# Altium project Team FF7 HD Remastered.PrjPcb
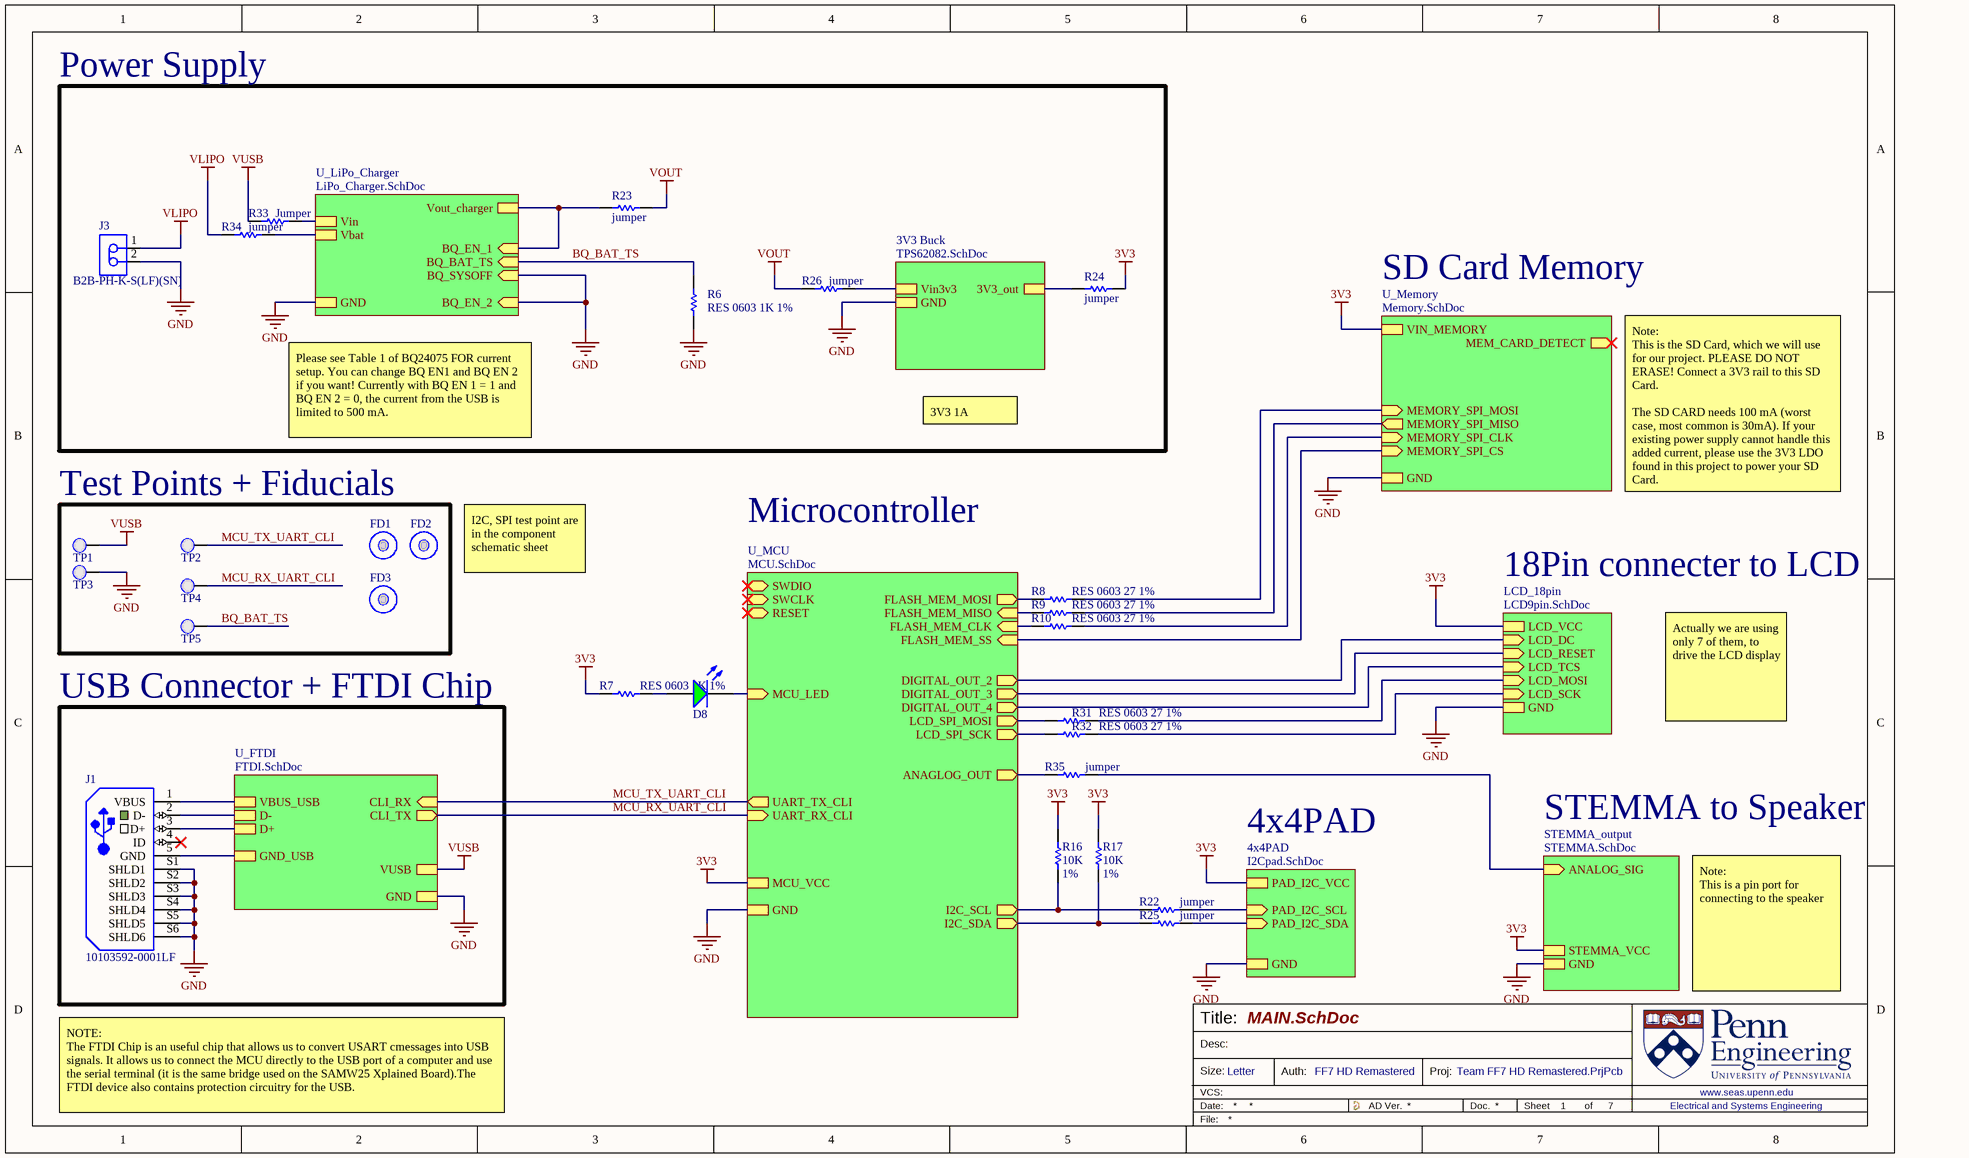
[diagram p0: MAIN.SchDoc]
9 sheets, 103 parts. Net scope: strictly hierarchical (ports join the sheet entries above them; power ports are local).
Board file: FF7_V1.0.PcbDoc
Sheets:
  MAIN.SchDoc
    U_FTDI = FTDI.SchDoc
    U_MCU = MCU.SchDoc
    U_Memory = Memory.SchDoc
    U_LiPo_Charger = LiPo_Charger.SchDoc
    STEMMA_output = STEMMA.SchDoc
    LCD_18pin = LCD9pin.SchDoc
    3V3 Buck = TPS62082.SchDoc
    4x4PAD = I2Cpad.SchDoc

## Sheet MAIN.SchDoc
size Legal; Author: FF7 HD Remastered; SheetNumber: 1; SheetTotal: 7

### Parts
D8  LSM0805452V  [LED_0805]  (value not drawn)
FD1  Fiducial 40x100mm  [Fiducial 40x100mm-Footprint-1]  (value not drawn)
FD2  Fiducial 40x100mm  [Fiducial 40x100mm-Footprint-1]  (value not drawn)
FD3  Fiducial 40x100mm  [Fiducial 40x100mm-Footprint-1]  (value not drawn)
J1  10103592-0001LF  [10103592-0001LF-Footprint-1]
J3  B2B-PH-K-S(LF)(SN)  [JST-B2B-PH-K-S_V]
R6  RES 0603 1K 1%  [0603_RES]
R7  RES 0603 1K 1%  [0603_RES]
R8  RES 0603 27 1%  [0603_RES]
R9  RES 0603 27 1%  [0603_RES]
R10  RES 0603 27 1%  [0603_RES]
R16  value 10K  Tolerance: 1%  [0402_RES]  (hidden comment: RES 0402 10K 1%)
R17  value 10K  Tolerance: 1%  [0402_RES]  (hidden comment: RES 0402 10K 1%)
R22  jumper  [0805_RES]  (no BOM)
R23  jumper  [0805_RES]  (no BOM)
R24  jumper  [0805_RES]  (no BOM)
R25  jumper  [0805_RES]  (no BOM)
R26  jumper  [0805_RES]  (no BOM)
R31  RES 0603 27 1%  [0603_RES]
R32  RES 0603 27 1%  [0603_RES]
R33  Jumper  [0805_RES]  (no BOM)
R34  jumper  [0805_RES]  (no BOM)
R35  jumper  [0805_RES]  (no BOM)
TP1  Test Point 0.1"  [Test Point 0.1"-Footprint-1]  (value not drawn)  (no BOM)
TP2  Test Point 0.1"  [Test Point 0.1"-Footprint-1]  (value not drawn)  (no BOM)
TP3  Test Point 0.1"  [Test Point 0.1"-Footprint-1]  (value not drawn)  (no BOM)
TP4  Test Point 0.1"  [Test Point 0.1"-Footprint-1]  (value not drawn)  (no BOM)
TP5  Test Point 0.1"  [Test Point 0.1"-Footprint-1]  (value not drawn)  (no BOM)

### Blocks framed on the sheet
Power Supply: J3 R6 R23 R24 R26 R33 R34
Test Points + Fiducials: FD1-FD3 TP1-TP5
USB Connector + FTDI Chip: J1

### Sub-sheets
3V3 Buck = TPS62082.SchDoc: Vin3v3, GND, 3V3_out
4x4PAD = I2Cpad.SchDoc: PAD_I2C_SCL (in), PAD_I2C_SDA (in), PAD_I2C_VCC, GND
LCD_18pin = LCD9pin.SchDoc: LCD_VCC, LCD_SCK (in), LCD_MOSI (in), LCD_DC (in), LCD_RESET (in), LCD_TCS (in), GND
STEMMA_output = STEMMA.SchDoc: ANALOG_SIG (in), STEMMA_VCC, GND
U_FTDI = FTDI.SchDoc: CLI_RX (in), CLI_TX (out), VUSB, GND, VBUS_USB, D-, D+, GND_USB
U_LiPo_Charger = LiPo_Charger.SchDoc: BQ_EN_2 (in), BQ_SYSOFF (in), BQ_EN_1 (in), BQ_BAT_TS (in), Vin, GND, Vbat, Vout_charger
U_MCU = MCU.SchDoc: SWDIO (bidir), SWCLK (in), UART_TX_CLI (out), UART_RX_CLI (in), FLASH_MEM_SS (in), FLASH_MEM_CLK (in), FLASH_MEM_MISO (in), FLASH_MEM_MOSI (out), RESET (bidir), MCU_LED (in), MCU_VCC, GND, I2C_SCL (out), I2C_SDA (out), ANAGLOG_OUT (out), DIGITAL_OUT_2 (out), LCD_SPI_MOSI (out), LCD_SPI_SCK (out), DIGITAL_OUT_3 (out), DIGITAL_OUT_4 (out)
U_Memory = Memory.SchDoc: MEMORY_SPI_MOSI (in), MEMORY_SPI_MISO (out), MEMORY_SPI_CLK (in), MEMORY_SPI_CS (in), MEM_CARD_DETECT (out), VIN_MEMORY, GND

### Nets
3V3: R7.2 R16.2 R17.2 R24.2 ; sheet U_MCU/MCU_VCC, sheet U_Memory/VIN_MEMORY, sheet STEMMA_output/STEMMA_VCC, sheet LCD_18pin/LCD_VCC, sheet 4x4PAD/PAD_I2C_VCC
GND: J1.5(GND) J1.S1(SHLD1) J1.S2(SHLD2) J1.S3(SHLD3) J1.S4(SHLD4) J1.S5(SHLD5) J1.S6(SHLD6) J3.2 R6.1 TP3.1(PAD) ; sheet U_FTDI/GND, sheet U_FTDI/GND_USB, sheet U_MCU/GND, sheet U_Memory/GND, sheet U_LiPo_Charger/BQ_EN_2, sheet U_LiPo_Charger/BQ_SYSOFF, sheet U_LiPo_Charger/GND, sheet STEMMA_output/GND, sheet LCD_18pin/GND, sheet 3V3 Buck/GND, sheet 4x4PAD/GND
Vbat: R34.2 ; sheet U_LiPo_Charger/Vbat
VBUS: J1.1(VBUS) ; sheet U_FTDI/VBUS_USB
Vin: R33.2 ; sheet U_LiPo_Charger/Vin
Vin3v3: R26.2 ; sheet 3V3 Buck/Vin3v3
VLIPO: J3.1 R34.1
VOUT: R23.2 R26.1
Vout_BQ: R23.1 ; sheet U_LiPo_Charger/BQ_EN_1, sheet U_LiPo_Charger/Vout_charger
VUSB: R33.1 TP1.1(PAD) ; sheet U_FTDI/VUSB
3V3_out: R24.1 ; sheet 3V3 Buck/3V3_out
ANALOG_OUT: R35.1 ; sheet U_MCU/ANAGLOG_OUT
ANALOG_SIG: R35.2 ; sheet STEMMA_output/ANALOG_SIG
BQ_BAT_TS: R6.2 TP5.1(PAD) ; sheet U_LiPo_Charger/BQ_BAT_TS
DIGITAL_OUT_2: sheet U_MCU/DIGITAL_OUT_2, sheet LCD_18pin/LCD_DC
DIGITAL_OUT_3: sheet U_MCU/DIGITAL_OUT_3, sheet LCD_18pin/LCD_RESET
DIGITAL_OUT_4: sheet U_MCU/DIGITAL_OUT_4, sheet LCD_18pin/LCD_TCS
FLASH_MEM_SPI_SS: sheet U_MCU/FLASH_MEM_SS, sheet U_Memory/MEMORY_SPI_CS
I2C_SCL: R16.1 R22.1 ; sheet U_MCU/I2C_SCL
I2C_SDA: R17.1 R25.1 ; sheet U_MCU/I2C_SDA
LCD_MOSI: R31.2 ; sheet LCD_18pin/LCD_MOSI
LCD_SCK: R32.2 ; sheet LCD_18pin/LCD_SCK
LCD_SPI_MOSI: R31.1 ; sheet U_MCU/LCD_SPI_MOSI
LCD_SPI_SCK: R32.1 ; sheet U_MCU/LCD_SPI_SCK
MCU_LED: D8.K ; sheet U_MCU/MCU_LED
MCU_RX_UART_CLI: TP4.1(PAD) ; sheet U_FTDI/CLI_TX, sheet U_MCU/UART_RX_CLI
MCU_TX_UART_CLI: TP2.1(PAD) ; sheet U_FTDI/CLI_RX, sheet U_MCU/UART_TX_CLI
MEM_SPI_CLK: R10.2 ; sheet U_Memory/MEMORY_SPI_CLK
MEM_SPI_MISO: R9.2 ; sheet U_Memory/MEMORY_SPI_MISO
MEM_SPI_MOSI: R8.2 ; sheet U_Memory/MEMORY_SPI_MOSI
PAD_I2C_SCL: R22.2 ; sheet 4x4PAD/PAD_I2C_SCL
PAD_I2C_SDA: R25.2 ; sheet 4x4PAD/PAD_I2C_SDA
SERCOM1_PAD2_SPI_MISO: R9.1 ; sheet U_MCU/FLASH_MEM_MISO
SERCOM1_PAD2_SPI_MOSI: R8.1 ; sheet U_MCU/FLASH_MEM_MOSI
SERCOM1_PAD3_SPI_SCK: R10.1 ; sheet U_MCU/FLASH_MEM_CLK
USB_DATA_N: J1.2(D-) ; sheet U_FTDI/D-
USB_DATA_P: J1.3(D+) ; sheet U_FTDI/D+
NetD8_A: D8.A R7.1

Not connected (* = marked no-connect by the designer): J1 4(ID)*

### Notes on the sheet
- SD Card Memory
- Please see Table 1 of BQ24075 FOR current setup. You can change BQ EN1 and BQ EN 2 if you want! Currently with BQ EN 1 = 1 and BQ EN 2 = 0, the current from the USB is limited to 500 mA.
- 3V3 1A
- Note:
  This is the SD Card, which we will use for our project. PLEASE DO NOT ERASE! Connect a 3V3 rail to this SD Card.
  The SD CARD needs 100 mA (worst case, most common is 30mA). If your existing power supply cannot handle this added current, please use the 3V3 LDO found in this project to power your SD Card.
- (near FD2) I2C, SPI test point are in the component schematic sheet
- Microcontroller
- 18Pin connecter to LCD
- Actually we are using only 7 of them, to drive the LCD display
- 4x4PAD
- STEMMA to Speaker
- Note:
  This is a pin port for connecting to the speaker
- NOTE:
  The FTDI Chip is an useful chip that allows us to convert USART cmessages into USB signals. It allows us to connect the MCU directly to the USB port of a computer and use the serial terminal (it is the same bridge used on the SAMW25 Xplained Board).The FTDI device also contains protection circuitry for the USB.
- Title:
- Desc:
- Size:
- Letter
- Auth:
- Proj:
- Sheet
- of
- www.seas.upenn.edu
- Electrical and Systems Engineering

### Library data of the parts
D8 = CMP-00038-3: Single Color LED, Green, 0805; Test Current: 20mA; Forward Voltage: 2V; RoHS Compliant: Yes
FD1-FD3 = CMP-00085-1
J1 = CMP-00092-5: Conn Micro USB 2.0 Type B RCP 5 POS 0.65mm Solder RA SMD 5 Terminal 1 Port T/R
J3 = CMP-2000-05162-1: Male Header, Pitch 2 mm, 1 x 2 Position, Height 6 mm, Tail Length 3.4 mm, -25 to 85 degC, RoHS, Bulk; Manufacturer: JST; Pitch: 2mm; Style/Orientation: StraightHeader/Plug; No of Positions: 2; Datasheet Version: Nov-08; Datasheet URL: http://datasheet.octopart.com/B2B-PH-K-S%28LF%29%28SN%29-JST-datasheet-8324864.pdf; Manufacturer URL: http://www.jst.com/home2.html; Type: ShroudedHeader; Termination: Crimp
R6 R7 = CMP-005-002503-2: Resistor Surface Mount, 1K Ohms, 0603 Footprint, 1% Tolerance 0.1W; Manufacturer: Various; PCB Package: 0603; Description in Visual: Res SMT 1K 0603  1%  0.1W; Tolerance: 1%; Value: 1k; Mount: SMT; Power Rating: 0.1W; Manufacturer P/N: RES 0603 1K 1%; JLCPCB Part #: C21190
R8-R10 R31 R32 = CMP-005-002764-1: Resistor Surface Mount, 27 Ohms, 0603 Footprint, 1% Tolerance 0.1W; Manufacturer P/N: RES 0603 27R 1%; Manufacturer: Various; Description in Visual: Res SMT 27 0603  1%  0.1W; Value: 27; PCB Package: 0603; Mount: SMT; Tolerance: 1%; Power Rating: 0.1W
R16 R17 = CMP-005-000226-3: Resistor Surface Mount, 10K Ohms, 0402 Footprint, 1% Tolerance 0.063W; Manufacturer: Various; PCB Package: 0402; Description in Visual: Res SMT 10K 0402  1%  0.063W; Manufacturer P/N: RES 0402 10K 1%; Power Rating: 0.063W; Mount: SMT
R22-R25 R33 R35 = CMP-005-003861-1: Resistor Surface Mount, 0 Ohms, 0805 Footprint, 5% Tolerance 0.125W; Manufacturer P/N: RES 0805 0R 5%; Manufacturer: Various; Description in Visual: Res SMT 0 0805  5%  0.125W; PCB Package: 0805; Value: 0; Mount: SMT; Power Rating: 0.125W; Tolerance: 5%
R26 R34 = CMP-005-003861-1: Resistor Surface Mount, 0 Ohms, 0805 Footprint, 5% Tolerance 0.125W; Manufacturer P/N: RES 0805 0R 5%; Manufacturer: Various; Description in Visual: Res SMT 0 0805  5%  0.125W; PCB Package: 0805; Mount: SMT; Power Rating: 0.125W
TP1-TP5 = CMP-00086-1

## Sheet FTDI.SchDoc
size Letter; Author: FF7 HD Remastered; SheetNumber: 4; SheetTotal: 7
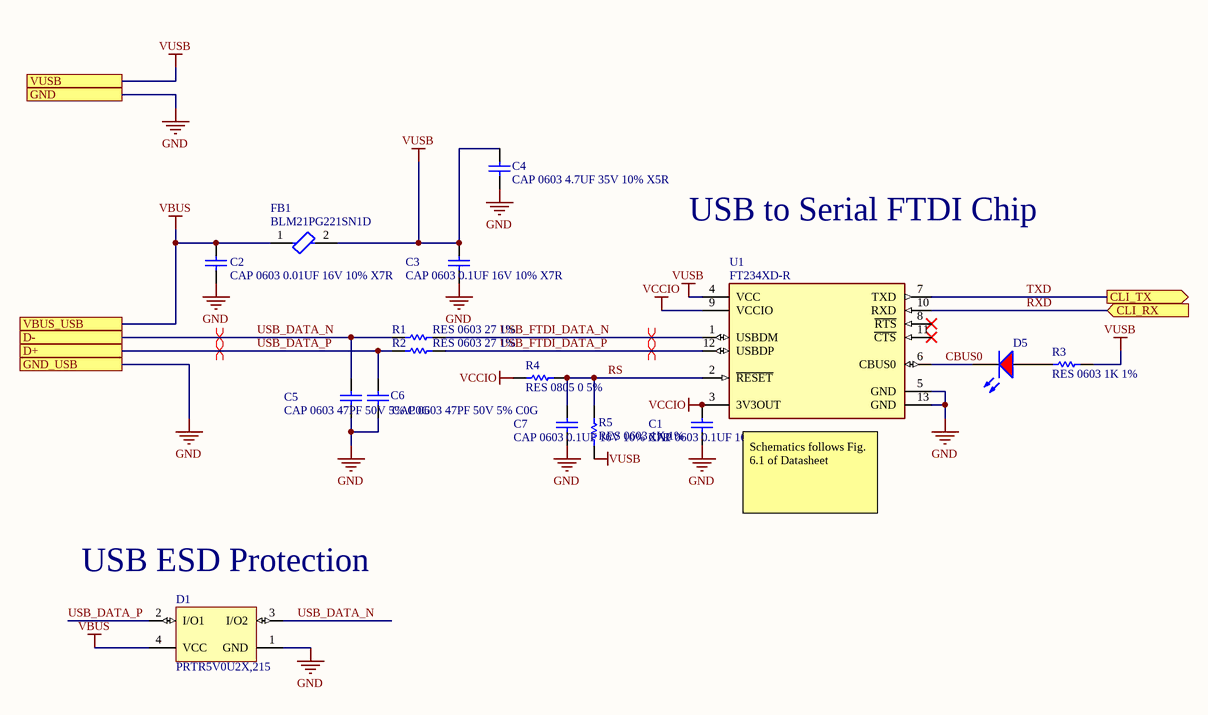
[diagram p1: FTDI.SchDoc]

### Parts
C1  CAP 0603 0.1UF 16V 10% X7R  [0603_CAP]
C2  CAP 0603 0.01UF 16V 10% X7R  [0603_CAP]
C3  CAP 0603 0.1UF 16V 10% X7R  [0603_CAP]
C4  CAP 0603 4.7UF 35V 10% X5R  [0603_CAP]
C5  CAP 0603 47PF 50V 5% C0G  [0603_CAP]
C6  CAP 0603 47PF 50V 5% C0G  [0603_CAP]
C7  CAP 0603 0.1UF 16V 10% X7R  [0603_CAP]
D1  PRTR5V0U2X,215  [NXP-SOT143B-4_V]
D5  LSM0805412V  [LED_0805_RED]  (value not drawn)
FB1  BLM21PG221SN1D  [FP-BLM21-0_2-t0_85-e0_5-IPC_B]
R1  RES 0603 27 1%  [0603_RES]
R2  RES 0603 27 1%  [0603_RES]
R3  RES 0603 1K 1%  [0603_RES]
R4  RES 0805 0 5%  [0805_RES]  (no BOM)
R5  RES 0603 1K 1%  [0603_RES]
U1  FT234XD-R  [FP-DFN-12-IPC_B]

### Ports
CLI_RX (in), CLI_TX (out), D+, D-, GND, GND_USB, VBUS_USB, VUSB

### Nets
GND: C1.1 C2.1 C3.1 C4.1 C5.1 C6.1 C7.1 D1.1(GND) U1.5(GND) U1.13(GND) ; port GND, port GND_USB
VBUS: C2.2 D1.4(VCC) FB1.1 ; port VBUS_USB
VCCIO: C1.2 R4.1 U1.3(3V3OUT) U1.9(VCCIO)
VUSB: C3.2 C4.2 FB1.2 R3.1 R5.1 U1.4(VCC) ; port VUSB
CBUS0: D5.K U1.6(CBUS0)  [project net CBUS0_4]
RS: C7.2 R4.2 R5.2 U1.2(~{RESET})  [project net RS_4]
RXD: U1.10(RXD) ; port CLI_RX  [project net MCU_TX_UART_CLI]
TXD: U1.7(TXD) ; port CLI_TX  [project net MCU_RX_UART_CLI]
USB_DATA_N: C5.2 D1.3(I/O2) R1.1 ; port D-
USB_DATA_P: C6.2 D1.2(I/O1) R2.1 ; port D+
USB_FTDI_DATA_N: R1.2 U1.1(USBDM)  [project net USB_FTDI_DATA_N_4]
USB_FTDI_DATA_P: R2.2 U1.12(USBDP)  [project net USB_FTDI_DATA_P_4]
NetD5_A: D5.A R3.2

Not connected (* = marked no-connect by the designer): U1 8(~{RTS})* 11(~{CTS})*

### Layout directives
differential pair: USB_DATA_N, USB_DATA_P, USB_FTDI_DATA_N_4, USB_FTDI_DATA_P_4

### Notes on the sheet
- USB to Serial FTDI Chip
- Schematics follows Fig. 6.1 of Datasheet
- (near D1) USB ESD Protection
- Title:
- Desc:
- Size:
- Letter
- Auth:
- Proj:
- Sheet
- of
- www.seas.upenn.edu
- Electrical and Systems Engineering

### Library data of the parts
C1 C3 C7 = CMP-011-000221-1: Capacitor Surface Mount 0603 Footprint 0.1UF 16V 10% Tolerance Ceramic X7R; Manufacturer: Various; Description in Visual: Cap SMT 0603 0.1UF 16V 10%  Cer X7R; PCB Package: 0603; Mount: SMT; Manufacturer P/N: CAP 0603 0.1UF 16V 10% X7R; Type: Ceramic X7R; Voltage: 16V; P/N: CAP 0603 0.1UF 16V 10% X7R; Value: 0.1UF; Tolerance: 10%
C2 = CMP-011-000185-1: Capacitor Surface Mount 0603 Footprint 0.01UF 16V 10% Tolerance Ceramic X7R; Manufacturer: Various; Description in Visual: Cap SMT 0603 0.01UF 16V 10%  Cer X7R; PCB Package: 0603; Type: Ceramic X7R; Manufacturer P/N: CAP 0603 0.01UF 16V 10% X7R; Value: 0.01UF; P/N: CAP 0603 0.01UF 16V 10% X7R; Voltage: 16V; Tolerance: 10%; Mount: SMT
C4 = CMP-011-000330-1: Capacitor Surface Mount 0603 Footprint 47UF 35V 10% Tolerance Ceramic X5R; Manufacturer: Various; PCB Package: 0603; P/N: CAP 0603 4.7UF 35V 10% X5R; Mount: SMT; Manufacturer P/N: CAP 0603 4.7UF 35V 10% X5R; Description in Visual: CAP 0603 4.7UF 35V 10% X5R; Type: Ceramic X5R
C5 C6 = CMP-011-000339-1: Capacitor Surface Mount 0603 Footprint 47PF 50V 5% Tolerance Ceramic C0G; Manufacturer: Various; Description in Visual: Cap SMT 0603 47PF 50V 5%  Cer C0G; PCB Package: 0603; Manufacturer P/N: CAP 0603 47PF 50V 5% C0G; Value: 47PF; Voltage: 50V; P/N: CAP 0603 47PF 50V 5% C0G; Mount: SMT; Tolerance: 5%; Type: Ceramic C0G
D1 = CMP-2000-05285-1: Ultra Low Capacitance Double Rail-to-Rail ESD Protection Diode, 5.5 V, 1 pF, -40 to 85 degC, 4-Pin SOT143B, RoHS, Tape and Reel; Manufacturer: NXP Semiconductors; Capacitance Value: 16pF; Number of Elements: 1; Rad Hardened: No; Reverse Breakdown Voltage: 6V; Working Voltage (Max): 5.5V; Polarity: Uni-Directional; Configuration: Quad; Leakage Current: 0.1uA; Product Height (mm): 1mm; Suppressor Type: DiodeArrays; Product Length (mm): 3mm; Product Depth (mm): 1.4mm; ESD Protection Voltage: 8KV@ContactDisc; Package Type: SOT; Mounting: SurfaceMount; Packaging: TapeandReel; Datasheet Version: Rev. 02, 01/2008; Reverse Stand-off Voltage: 5.5V; Manufacturer URL: http://www.nxp.com/; Operating Temp Range: -40Cto85C; Operating Temperature Classification: Industrial; Working Voltage: 5.5V; Operating Temperature Min Deg. C: -40C; Datasheet URL: https://datasheet.ciiva.com/4479/prtr5v0u2x-102853-4479461.pdf; Leakage Current (Max): 0.1uA; Direction Type: Uni-Directional; Pin Count: 3+Tab; Operating Temperature Max Deg. C: 85C; Mounting Style: SurfaceMount; Package / Case: SOT
D5 = CMP-00026-00001-1: Single Color LED, RED, 0805; Test Current: 20mA; Forward Voltage: 2V; RoHS Compliant: Yes
FB1 = CMP-0686-00610-3: Chip Ferrite Bead, 0805, 220Ω @ 100MHz, 0.045Ω, 25%, 2A; Number of Circuits: 1; Shielding: Unshielded; DC Resistance (DCR): 45mR; Impedance: 220R; Radiation Hardening: No; Material: Ferrite; Frequency: 100MHz; Width: 1.25mm; DC Current: 2A; Max DC Current: 2A; Number of Lines: 1; Package Quantity: 1; Case Code (Metric): 2012; Current Rating: 2A; Case/Package: 0805; Current: 2A; Military Standard: Not; Core Material: Ferrite; Depth: 1.25mm; Contact Plating: Tin; DC Resistance-Max: 45mR; Max Operating Temperature: 125°C; Length: 2mm; Max Current Rating: 2A; REACH SVHC: No SVHC; Termination: SMD/SMT; Min Operating Temperature: -55°C; Series: BLM21P; Test Frequency: 100MHz; Tolerance: 25%; Number of Pins: 2; RoHS Compliant: Yes; Height: 0.85mm; Packaging: Tape and Reel; Lead Free: Lead Free; Case Code (Imperial): 0805
R1 R2 = CMP-005-002764-1: as R8 on sheet MAIN; Mount: SMT; Tolerance: 1%; Power Rating: 0.1W
R3 R5 = CMP-005-002503-2: as R6 on sheet MAIN; Tolerance: 1%; Value: 1k; Mount: SMT; Power Rating: 0.1W; Manufacturer P/N: RES 0603 1K 1%; JLCPCB Part #: C21190
R4 = CMP-005-003861-1: as R22 on sheet MAIN; Mount: SMT; Power Rating: 0.125W; Tolerance: 5%
U1 = CMP-0248-00027-3: IC USB SERIAL BASIC UART 12DFN; Min Supply Voltage: 2.97V; Number of Ports: 1; Operating Supply Voltage: 5V; Operating Supply Current: 8mA; Max Supply Voltage: 5.5V; Data Rate: 3Mbps; Length: 3mm; Case/Package: DFN; Mount: Surface Mount; Packaging: Tape and Reel; Max Operating Temperature: 85°C; Height: 0.75mm; Number of Pins: 12; Number of Transceivers: 1; Package Quantity: 5000; Min Operating Temperature: -40°C; Width: 3mm; REACH SVHC: No SVHC; Interface: UART; Lead Free: Lead Free

## Sheet MCU.SchDoc
size Legal; Author: FF7 HD Remastered; SheetNumber: 3; SheetTotal: 7
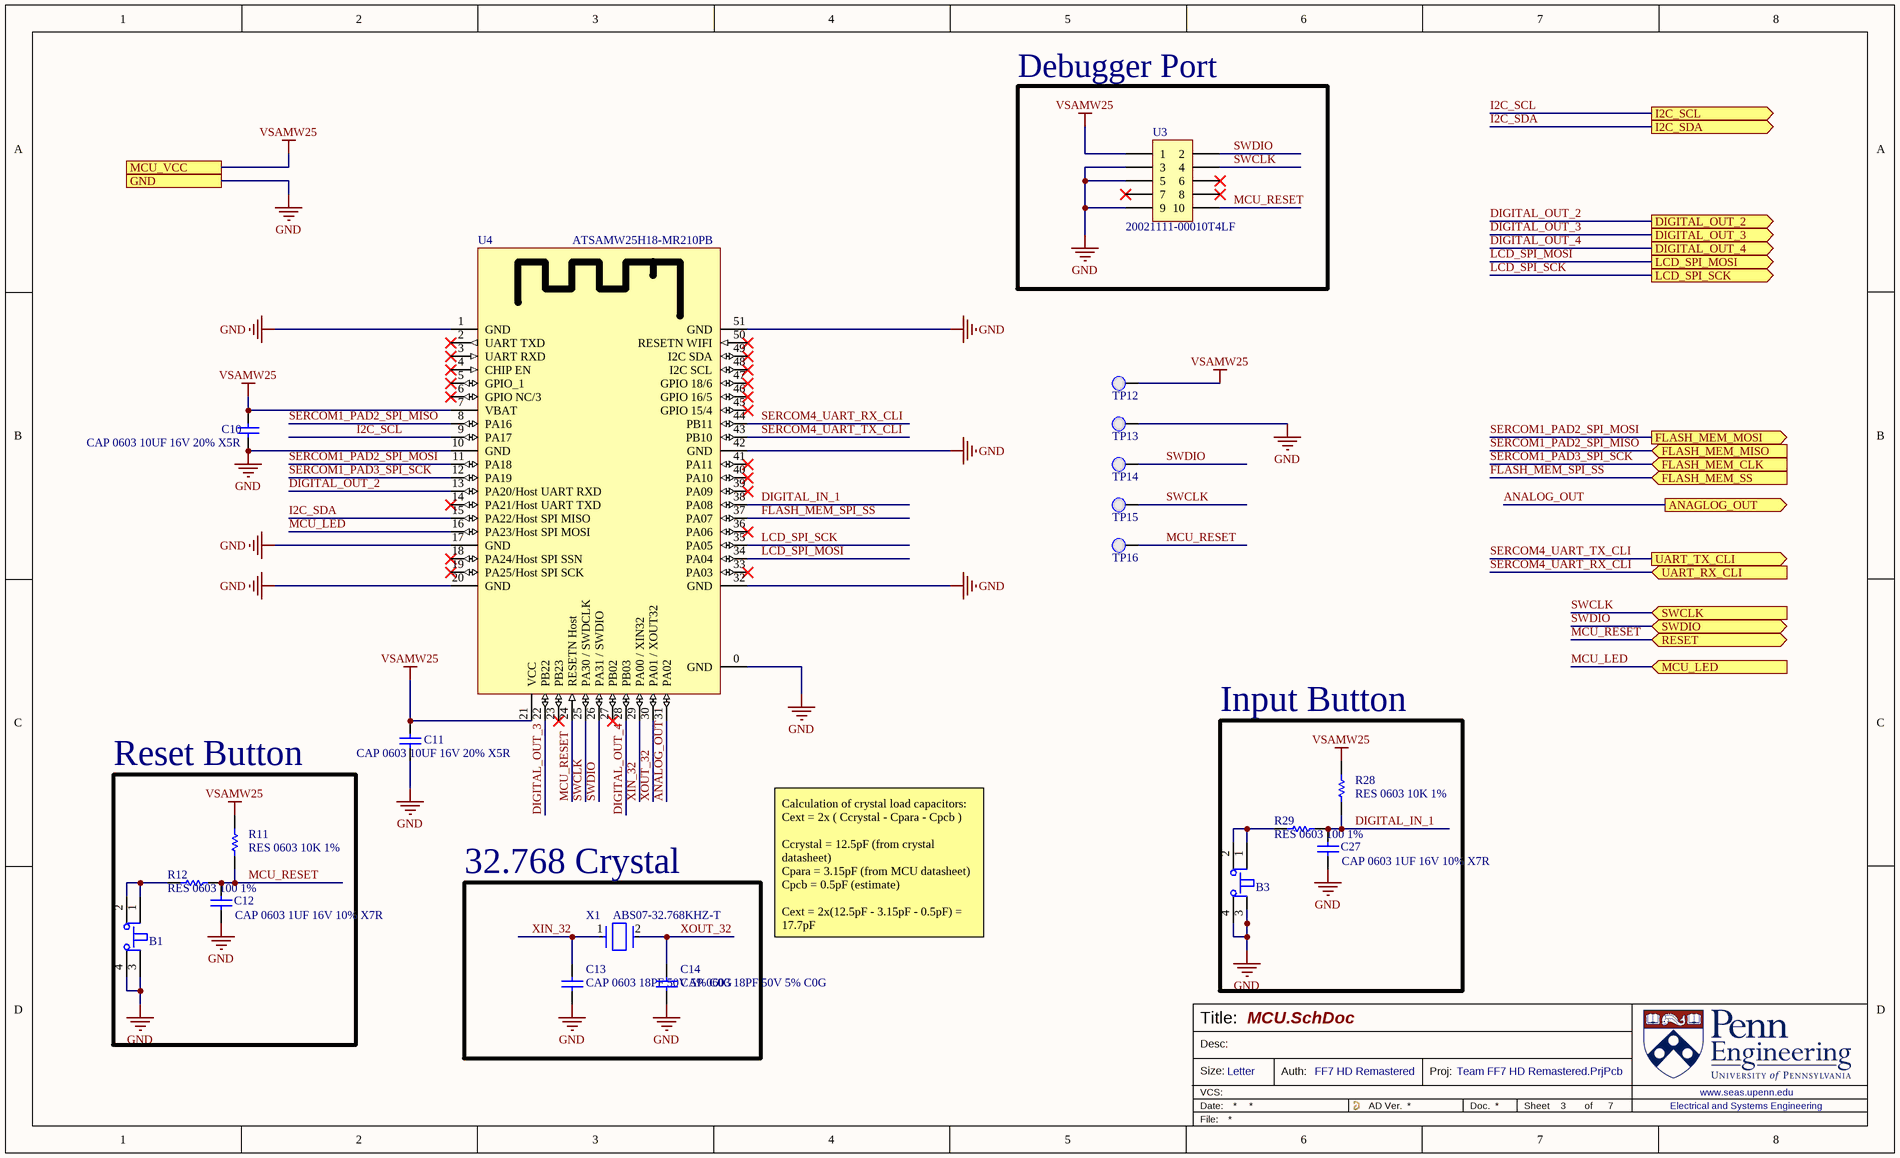
[diagram p2: MCU.SchDoc]

### Parts
B1  PTS810SJK250SMTRLFS  [PTS810SJK250SMTRLFS-Footprint-1]  (value not drawn)
B3  PTS810SJK250SMTRLFS  [PTS810SJK250SMTRLFS-Footprint-1]  (value not drawn)
C10  CAP 0603 10UF 16V 20% X5R  [0603_CAP]
C11  CAP 0603 10UF 16V 20% X5R  [0603_CAP]
C12  CAP 0603 1UF 16V 10% X7R  [0603_CAP]
C13  CAP 0603 18PF 50V 5% C0G  [0603_CAP]
C14  CAP 0603 18PF 50V 5% C0G  [0603_CAP]
C27  CAP 0603 1UF 16V 10% X7R  [0603_CAP]
R11  RES 0603 10K 1%  [0603_RES]
R12  RES 0603 100 1%  [0603_RES]
R28  RES 0603 10K 1%  [0603_RES]
R29  RES 0603 100 1%  [0603_RES]
TP12  Test Point 0.1"  [Test Point 0.1"-Footprint-1]  (value not drawn)  (no BOM)
TP13  Test Point 0.1"  [Test Point 0.1"-Footprint-1]  (value not drawn)  (no BOM)
TP14  Test Point 0.1"  [Test Point 0.1"-Footprint-1]  (value not drawn)  (no BOM)
TP15  Test Point 0.1"  [Test Point 0.1"-Footprint-1]  (value not drawn)  (no BOM)
TP16  Test Point 0.1"  [Test Point 0.1"-Footprint-1]  (value not drawn)  (no BOM)
U3  20021111-00010T4LF  [20021111-00010T4LF-Footprint-1]
U4  ATSAMW25H18-MR210PB  [SAMW25H18-MR510PB-Footprint-1]
X1  ABS07-32.768KHZ-T  [FP-ABS07-MFG]

### Blocks framed on the sheet
Debugger Port: U3
Input Button: B3 C27 R28 R29
Reset Button: B1 C12 R11 R12
32.768 Crystal: C13 C14 X1

### Ports
ANAGLOG_OUT (out), DIGITAL_OUT_2 (out), DIGITAL_OUT_3 (out), DIGITAL_OUT_4 (out), FLASH_MEM_CLK (in), FLASH_MEM_MISO (in), FLASH_MEM_MOSI (out), FLASH_MEM_SS (in), GND, I2C_SCL (out), I2C_SDA (out), LCD_SPI_MOSI (out), LCD_SPI_SCK (out), MCU_LED (in), MCU_VCC, RESET (bidir), SWCLK (in), SWDIO (bidir), UART_RX_CLI (in), UART_TX_CLI (out)

### Nets
GND: B1.3 B1.4 B3.3 B3.4 C10.1 C11.1 C12.1 C13.1 C14.1 C27.1 TP13.1(PAD) U3.3 U3.5 U3.9 U4.0(GND) U4.1(GND) U4.10(GND) U4.17(GND) U4.20(GND) U4.32(GND) U4.42(GND) U4.51(GND) ; port GND
VSAMW25: C10.2 C11.2 R11.2 R28.2 TP12.1(PAD) U3.1 U4.7(VBAT) U4.21(VCC) ; port MCU_VCC  [project net 3V3]
ANALOG_OUT: U4.31(PA02) ; port ANAGLOG_OUT
DIGITAL_IN_1: C27.2 R28.1 R29.2 U4.38(PA08)  [project net DIGITAL_IN_1_3]
DIGITAL_OUT_2: U4.13(PA20/Host_UART_RXD) ; port DIGITAL_OUT_2
DIGITAL_OUT_3: U4.22(PB22) ; port DIGITAL_OUT_3
DIGITAL_OUT_4: U4.28(PB03) ; port DIGITAL_OUT_4
FLASH_MEM_SPI_SS: U4.37(PA07) ; port FLASH_MEM_SS
I2C_SCL: U4.9(PA17) ; port I2C_SCL
I2C_SDA: U4.15(PA22/Host_SPI_MISO) ; port I2C_SDA
LCD_SPI_MOSI: U4.34(PA04) ; port LCD_SPI_MOSI
LCD_SPI_SCK: U4.35(PA05) ; port LCD_SPI_SCK
MCU_LED: U4.16(PA23/Host_SPI_MOSI) ; port MCU_LED
MCU_RESET: C12.2 R11.1 R12.2 TP16.1(PAD) U3.10 U4.24(RESETN_Host) ; port RESET
SERCOM1_PAD2_SPI_MISO: U4.8(PA16) ; port FLASH_MEM_MISO
SERCOM1_PAD2_SPI_MOSI: U4.11(PA18) ; port FLASH_MEM_MOSI
SERCOM1_PAD3_SPI_SCK: U4.12(PA19) ; port FLASH_MEM_CLK
SERCOM4_UART_RX_CLI: U4.44(PB11) ; port UART_RX_CLI  [project net MCU_RX_UART_CLI]
SERCOM4_UART_TX_CLI: U4.43(PB10) ; port UART_TX_CLI  [project net MCU_TX_UART_CLI]
SWCLK: TP15.1(PAD) U3.4 U4.25(PA30_/_SWDCLK) ; port SWCLK
SWDIO: TP14.1(PAD) U3.2 U4.26(PA31_/_SWDIO) ; port SWDIO
XIN_32: C13.2 U4.29(PA00_/_XIN32) X1.1  [project net XIN_32_3]
XOUT_32: C14.2 U4.30(PA01_/_XOUT32) X1.2  [project net XOUT_32_3]
NetB1_1: B1.1 B1.2 R12.1
NetB3_1: B3.1 B3.2 R29.1

Not connected (* = marked no-connect by the designer): U3 6* 7* 8*; U4 2(UART_TXD)* 3(UART_RXD)* 4(CHIP_EN)* 5(GPIO_1)* 6(GPIO_NC/3)* 14(PA21/Host_UART_TXD)* 18(PA24/Host_SPI_SSN)* 19(PA25/Host_SPI_SCK)* 23(PB23)* 27(PB02)* 33(PA03)* 36(PA06)* 39(PA09)* 40(PA10)* 41(PA11)* 45(GPIO_15/4)* 46(GPIO_16/5)* 47(GPIO_18/6)* 48(I2C_SCL)* 49(I2C_SDA)* 50(RESETN_WIFI)*

### Notes on the sheet
- Calculation of crystal load capacitors:
  Cext = 2x ( Ccrystal - Cpara - Cpcb )
  Ccrystal = 12.5pF (from crystal datasheet)
  Cpara = 3.15pF (from MCU datasheet)
  Cpcb = 0.5pF (estimate)
  Cext = 2x(12.5pF - 3.15pF - 0.5pF) = 17.7pF
- Title:
- Desc:
- Size:
- Letter
- Auth:
- Proj:
- Sheet
- of
- www.seas.upenn.edu
- Electrical and Systems Engineering

### Library data of the parts
B1 B3 = CMP-00084-2: Keypad Switch, 1 Switches, SPST, Momentary-tactile, 0.05A, 16VDC, 3.23N, Solder Terminal, Surface Mount-straight; Manufacturer Series: PTS810; Actuator Length: 0.028inch; Electrical Life: 50000Cycles; Contact Resistance: 0.5mR; Solderability: REFLOW; Actuator Travel: 0.1524mm; Actuator Color: White; Actuator Type: Pushbutton; Insulation Resistance: 100MR; Dielectric Withstand Volts: 250VACV; Switch Function: OFF-MOM; Reach SVHC Compliant: Yes; Terminal Finish: Silver; Switch Type: Keypad; Switch Action: MOMENTARY; RoHS Compliant: Yes; JESD-609 Code: e4; Max Operating Temperature: 85°C; Termination: Solder; Min Operating Temperature: -40°C; Mounting Technology: Surface Mount; Circuit: SPST; Type: Tactile
C10 C11 = CMP-011-000263-1: Capacitor Surface Mount 0603 Footprint 10UF 16V 20% Tolerance Ceramic X5R; Manufacturer: Various; Description in Visual: Cap SMT 0603 10UF 16V 20% Ceramic X5R; PCB Package: 0603; Type: Ceramic X5R; Mount: SMT; P/N: CAP 0603 10UF 16V 20% X5R; Manufacturer P/N: CAP 0603 10UF 16V 20% X5R
C12 C27 = CMP-011-000286-1: Capacitor Surface Mount 0603 Footprint 1UF 16V 10% Tolerance Ceramic X7R; Manufacturer: Various; PCB Package: 0603; Description in Visual: Cap SMT 0603 1UF 16V 10% Ceramic X7R; P/N: CAP 0603 1UF 16V 10% X7R; Manufacturer P/N: CAP 0603 1UF 16V 10% X7R; Tolerance: 10%; Type: Ceramic X7R; Value: 1UF; Mount: SMT; Voltage: 16V
C13 C14 = CMP-011-000283-1: Capacitor Surface Mount 0603 Footprint 18PF 50V 5% Tolerance Ceramic C0G; Manufacturer: Various; Description in Visual: Cap SMT 0603 18PF 50V 5%  Cer C0G; PCB Package: 0603; Voltage: 50V; Type: Ceramic C0G; Tolerance: 5%; Manufacturer P/N: CAP 0603 18PF 50V 5% C0G; Value: 18PF; P/N: CAP 0603 18PF 50V 5% C0G; Mount: SMT
R11 R28 = CMP-005-002156-2: Resistor Surface Mount, 10K Ohms, 0603 Footprint, 1% Tolerance 0.1W; Manufacturer: Various; PCB Package: 0603; Description in Visual: Res SMT 10K 0603  1%  0.1W; Manufacturer P/N: RES 0603 10K 1%; Tolerance: 1%; Mount: SMT; Value: 10k; JLCPCB Part #: C25804; Power Rating: 0.1W
R12 R29 = CMP-005-002125-1: Resistor Surface Mount, 100 Ohms, 0603 Footprint, 1% Tolerance 0.1W; Manufacturer: Various; Manufacturer P/N: RES 0603 100R 1%; Value: 100; Description in Visual: Res SMT 100 0603  1%  0.1W; PCB Package: 0603; Mount: SMT; Tolerance: 1%; Power Rating: 0.1W
TP12-TP16 = CMP-00086-1
U3 = CMP-00083-1: Board Connector, 10 Contact(s), 2 Row(s), Male, Straight, 0.05 inch Pitch, Solder Terminal, Locking, Black Insulator, Receptacle; Number Of PCB Rows: 2; PCB Contact Pattern: RECTANGULAR; Option: General Purpose; Body Depth: 0.098inch; Insulation Resistance: 100MR; Dielectric Withstanding Voltage (AC): 700V; Withdrawl Force-Min: 0.1946N; Body Length: 0.25inch; IEC Conformance: No; Body Breadth: 0.135inch; Rated Current (Signal): 1A; Plating Thickness: 10uin; Reliability: COMMERCIAL; Number Of Connectors: 1; PCB Contact Row Spacing: 1.27mm; Insertion Force-Max: 2.1406N; Contact Style: SQ PIN-SKT; Durability: 100Cycles; Contact Resistance: 30mR; Number of Contacts: 10; Reference Standard: UL; Insulation Material: Thermoplastic; Connector Type: BOARD CONNECTOR; Termination: Solder; Contact Finish - Mating: GOLD (10); Mounting Technology: Board; RoHS Compliant: Yes; Terminal Length: 0.091inch; Body/Shell Style: RECEPTACLE; Number of Rows Loaded: 2; Contact Gender: Male; Terminal Pitch: 1.27mm; Max Operating Temperature: 125°C; Mounting Option 1: LOCKING; JESD-609 Code: e3; DIN Conformance: No; Reach SVHC Compliant: Yes; Contact Finish - Termination: Matte Tin (Sn); Mounting Style: STRAIGHT; Min Operating Temperature: -40°C; MIL Conformance: No; Contact Material: Copper Alloy; Filter Feature: No; Mating Contact Pitch: 0.05inch; Insulation Color: Black; Flammability Rating: UL94 V-0; Mating Contact Row Spacing: 0.05inch; Mixed Contacts: No; Contact Pattern: RECTANGULAR
U4 = CMP-00082-2: 2.7 - 4.2 V 65 Mbps 17 dbm 256 kB Flash 32 kB SRAM 802.11 b/g/n Smart Module
X1 = CMP-0447-00001-4: Crystal 32.768kHz ±20ppm (Tol) 12.5pF FUND 70kΩ 2-Pin CSMD T/R; ESR (Equivalent Series Resistance): 70kR; Frequency: 32.768kHz; Radiation Hardening: No; Length: 3.2mm; Max Operating Temperature: 85°C; Number of Pins: 2; Series: ABS07; Min Operating Temperature: -40°C; Frequency Tolerance: 20ppm; Packaging: Tape and Reel; Height: 0.9mm; Width: 1.5mm; Depth: 1.5mm; Load Capacitance: 12.5pF; RoHS Compliant: Yes; Tolerance: 20ppm; Termination: SMD/SMT; Lead Free: Lead Free; Series Resistance: 70kR; REACH SVHC: No SVHC; Case/Package: CSMD; Operating Frequency: 32.768 kHz; Package Quantity: 3000

## Sheet Memory.SchDoc
size Letter; Author: FF7 HD Remastered; SheetNumber: 2; SheetTotal: 7
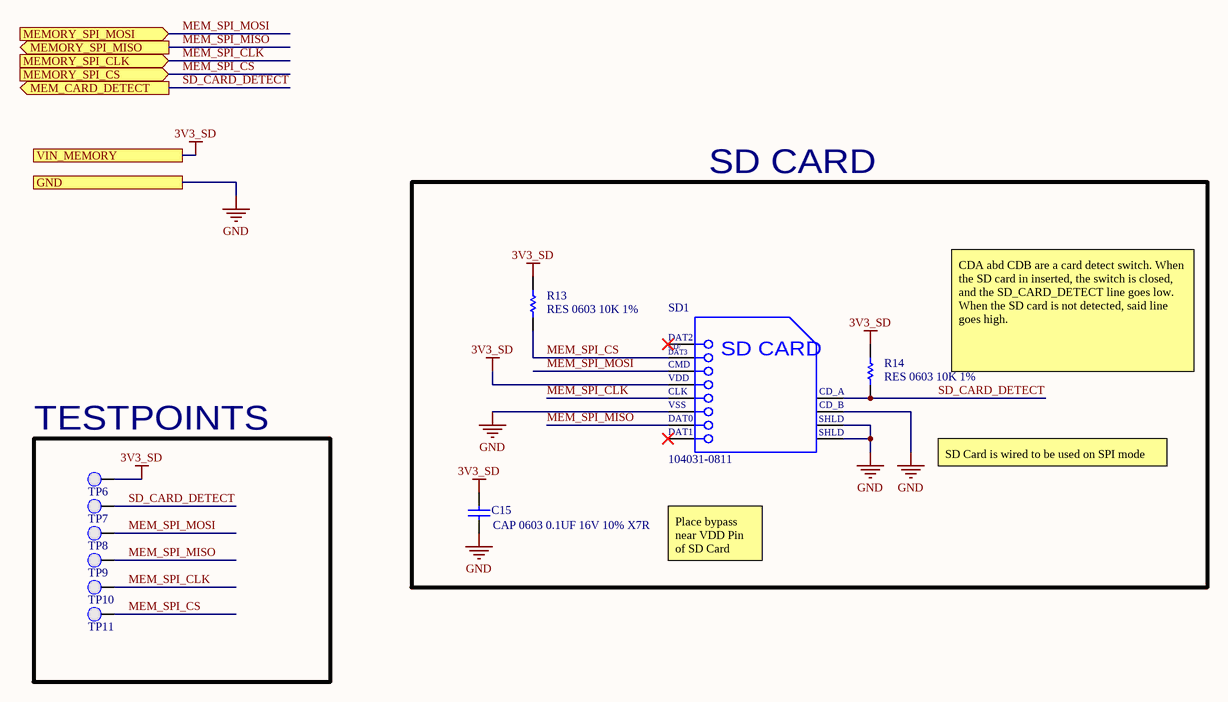
[diagram p3: Memory.SchDoc]

### Parts
C15  CAP 0603 0.1UF 16V 10% X7R  [0603_CAP]
R13  RES 0603 10K 1%  [0603_RES]
R14  RES 0603 10K 1%  [0603_RES]
SD1  104031-0811  [MOLX-104031-0811_V]
TP6  Test Point 0.1"  [Test Point 0.1"-Footprint-1]  (value not drawn)  (no BOM)
TP7  Test Point 0.1"  [Test Point 0.1"-Footprint-1]  (value not drawn)  (no BOM)
TP8  Test Point 0.1"  [Test Point 0.1"-Footprint-1]  (value not drawn)  (no BOM)
TP9  Test Point 0.1"  [Test Point 0.1"-Footprint-1]  (value not drawn)  (no BOM)
TP10  Test Point 0.1"  [Test Point 0.1"-Footprint-1]  (value not drawn)  (no BOM)
TP11  Test Point 0.1"  [Test Point 0.1"-Footprint-1]  (value not drawn)  (no BOM)

### Blocks framed on the sheet
SD CARD: C15 R13 R14 SD1
TESTPOINTS: TP6-TP11

### Ports
GND, MEM_CARD_DETECT (out), MEMORY_SPI_CLK (in), MEMORY_SPI_CS (in), MEMORY_SPI_MISO (out), MEMORY_SPI_MOSI (in), VIN_MEMORY

### Nets
3V3_SD: C15.2 R13.2 R14.2 SD1.4(VDD) TP6.1(PAD) ; port VIN_MEMORY  [project net 3V3]
GND: C15.1 SD1.6(VSS2) SD1.10(CD_B) SD1.11(SHLD1) SD1.12(SHLD2) ; port GND
MEM_SPI_CLK: SD1.5(CLK) TP10.1(PAD) ; port MEMORY_SPI_CLK
MEM_SPI_CS: R13.1 SD1.2(CMD) TP11.1(PAD) ; port MEMORY_SPI_CS  [project net FLASH_MEM_SPI_SS]
MEM_SPI_MISO: SD1.7(DAT0) TP9.1(PAD) ; port MEMORY_SPI_MISO
MEM_SPI_MOSI: SD1.3(VSS1) TP8.1(PAD) ; port MEMORY_SPI_MOSI
SD_CARD_DETECT: R14.1 SD1.9(CD_A) TP7.1(PAD) ; port MEM_CARD_DETECT

Not connected (* = marked no-connect by the designer): SD1 1(CD/DAT3)* 8(DAT1)*

### Notes on the sheet
- CDA abd CDB are a card detect switch. When the SD card in inserted, the switch is closed, and the SD_CARD_DETECT line goes low. When the SD card is not detected, said line goes high.
- SD Card is wired to be used on SPI mode
- Place bypass near VDD Pin of SD Card
- Title:
- Desc:
- Size:
- Letter
- Auth:
- Proj:
- Sheet
- of
- www.seas.upenn.edu
- Electrical and Systems Engineering
- (in symbol CMP-2000-05825-1) DAT2; CD/; DAT3; SD CARD; VSS; SHLD

### Library data of the parts
C15 = CMP-011-000221-1: as C1 on sheet FTDI; Mount: SMT; Manufacturer P/N: CAP 0603 0.1UF 16V 10% X7R; Type: Ceramic X7R; Voltage: 16V; P/N: CAP 0603 0.1UF 16V 10% X7R; Value: 0.1UF; Tolerance: 10%
R13 R14 = CMP-005-002156-2: as R11 on sheet MCU; Manufacturer P/N: RES 0603 10K 1%; Tolerance: 1%; Mount: SMT; Value: 10k; JLCPCB Part #: C25804; Power Rating: 0.1W
SD1 = CMP-2000-05825-1: Micro SD Card, RA, -25 to 85 degC, 8-Pin SMD, RoHS, Tape and Reel; Voltage Rating: 10VAC/DC; Number of Contacts: 8; Insertion - Extraction Style: Push-Pull; Pitch: 1.1mm; Mating Cycles: 10000; Brand: Molex; Current Rating: 500mA; Manufacturer URL: http://www.molex.com/; Card Type: microSD; Mounting Type: Standard; Height: 1.42mm; Mounting Technology: SurfaceMount; Contact Plating: Gold; Product Category: MemoryCardConnectors; Package Description: 8-Pin Surface Mount Device, Body 11.95 x 11.4 mm, Pitch 1.1 mm; Datasheet URL: http://www.molex.com/pdm_docs/sd/1040310811_sd.pdf; Termination Style: SMD; Length: 11.4mm; Housing Material: LiquidCrystalPolymer(LCP); Orientation: RightAngle; RoHS: True; Contact Material: PhosphorBronze; Datasheet Version: Rev. E, 04/2006; Packaging: Reel; Manufacturer: Molex; Series: 104031; Product: CardConnectors; Number of Rows: 1Row; Package Reference: 104031-0811
TP6-TP11 = CMP-00086-1

## Sheet LiPo_Charger.SchDoc
size Letter; Author: FF7 HD Remastered; SheetNumber: 5; SheetTotal: 7
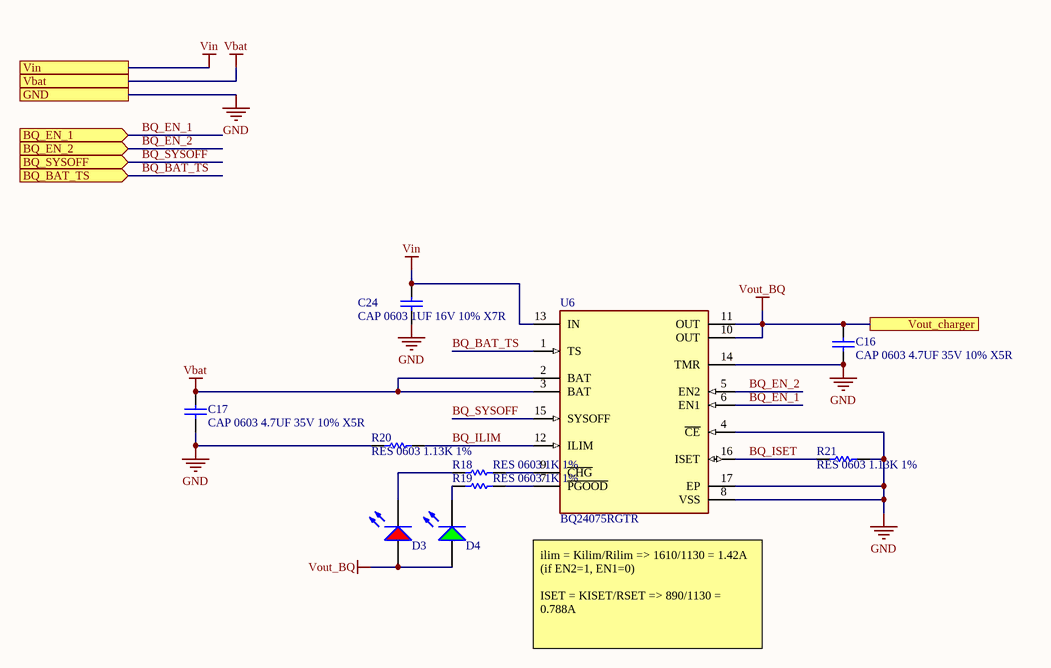
[diagram p4: LiPo_Charger.SchDoc]

### Parts
C16  CAP 0603 4.7UF 35V 10% X5R  [0603_CAP]
C17  CAP 0603 4.7UF 35V 10% X5R  [0603_CAP]
C24  CAP 0603 1UF 16V 10% X7R  [0603_CAP]
D3  LSM0805412V  [LED_0805_RED]  (value not drawn)
D4  LSM0805452V  [LED_0805]  (value not drawn)
R18  RES 0603 1K 1%  [0603_RES]
R19  RES 0603 1K 1%  [0603_RES]
R20  RES 0603 1.13K 1%  [0603_RES]
R21  RES 0603 1.13K 1%  [0603_RES]
U6  BQ24075RGTR  [FP-RGT0016C-IPC_A]

### Ports
BQ_BAT_TS (in), BQ_EN_1 (in), BQ_EN_2 (in), BQ_SYSOFF (in), GND, Vbat, Vin, Vout_charger

### Nets
GND: C16.1 C17.1 C24.1 R20.1 R21.2 U6.4(~{CE}) U6.5(EN2) U6.8(VSS) U6.14(TMR) U6.15(SYSOFF) U6.17(EP) ; port BQ_EN_2, port BQ_SYSOFF, port GND  [also labelled BQ_EN_2, BQ_SYSOFF]
Vbat: C17.2 U6.2(BAT) U6.3(BAT) ; port Vbat
Vin: C24.2 U6.13(IN) ; port Vin
Vout_BQ: C16.2 D3.A D4.A U6.6(EN1) U6.10(OUT) U6.11(OUT) ; port BQ_EN_1, port Vout_charger  [also labelled BQ_EN_1]
BQ_BAT_TS: U6.1(TS) ; port BQ_BAT_TS
BQ_ILIM: R20.2 U6.12(ILIM)  [project net BQ_ILIM_5]
BQ_ISET: R21.1 U6.16(ISET)  [project net BQ_ISET_5]
NetD3_K: D3.K R18.2
NetD4_K: D4.K R19.2
NetR18_1: R18.1 U6.9(~{CHG})
NetR19_1: R19.1 U6.7(~{PGOOD})

### Notes on the sheet
- (near U6) ilim = Kilim/Rilim => 1610/1130 = 1.42A (if EN2=1, EN1=0)
  ISET = KISET/RSET => 890/1130 = 0.788A
- Title:
- Desc:
- Size:
- Letter
- Auth:
- Proj:
- Sheet
- of
- www.seas.upenn.edu
- Electrical and Systems Engineering

### Library data of the parts
C16 C17 = CMP-011-000330-1: as C4 on sheet FTDI; P/N: CAP 0603 4.7UF 35V 10% X5R; Mount: SMT; Manufacturer P/N: CAP 0603 4.7UF 35V 10% X5R; Description in Visual: CAP 0603 4.7UF 35V 10% X5R; Type: Ceramic X5R
C24 = CMP-011-000286-1: as C12 on sheet MCU; P/N: CAP 0603 1UF 16V 10% X7R; Manufacturer P/N: CAP 0603 1UF 16V 10% X7R; Tolerance: 10%; Type: Ceramic X7R; Value: 1UF; Mount: SMT; Voltage: 16V
D3 = CMP-00026-00001-1: as D5 on sheet FTDI; RoHS Compliant: Yes
D4 = CMP-00038-3: as D8 on sheet MAIN; RoHS Compliant: Yes
R18 R19 = CMP-005-002503-2: as R6 on sheet MAIN; Tolerance: 1%; Value: 1k; Mount: SMT; Power Rating: 0.1W; Manufacturer P/N: RES 0603 1K 1%; JLCPCB Part #: C21190
R20 R21 = CMP-005-001984-1: Resistor Surface Mount, 1.13K Ohms, 0603 Footprint, 1% Tolerance 0.1W; Manufacturer: Various; Description in Visual: Res SMT 1.13K 0603  1%  0.1W; PCB Package: 0603; Power Rating: 0.1W; Mount: SMT; Tolerance: 1%; Manufacturer P/N: RES 0603 1.13K 1%; Value: 1.13K
U6 = CMP-0321-00238-3: IC LI-ION CHARGE MGMT 16-QFN; Max Supply Voltage: 6.4V; Number of Cells: 1; Min Supply Voltage: 4.35V; Battery Chemistry: LITHIUM-ION; Max Charge Current: 1.5A; Output Voltage: 4.2V; Interface: USB; Min Input Voltage: 4.3V; Fault Protection: Over Voltage; Weight: 0.000808oz; Package Quantity: 3000; Min Operating Temperature: -40°C; Case/Package: VQFN; Lead Free: Lead Free; Number of Pins: 16; RoHS Compliant: Yes; Series: -; Packaging: Tape and Reel; Output Current: 1.5A; Contact Plating: Gold; Battery Pack Voltage: 4.2V; Max Operating Temperature: 125°C; Radiation Hardening: No

## Sheet STEMMA.SchDoc
size Letter; Author: FF7 HD Remastered
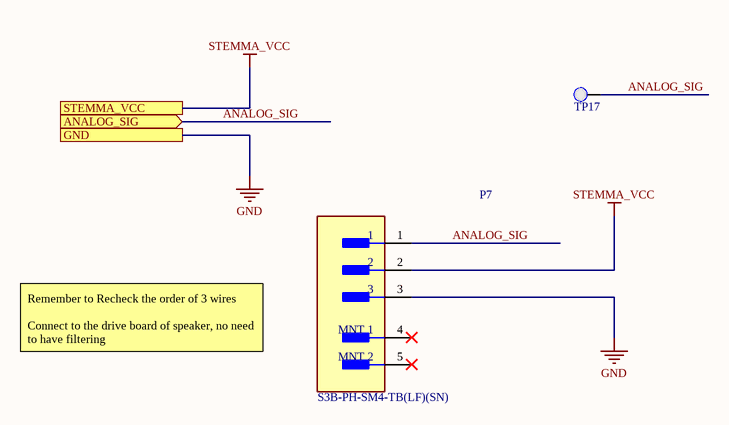
[diagram p5: STEMMA.SchDoc]

### Parts
P7  S3B-PH-SM4-TB(LF)(SN)  [FP-S3B-PH-SM4-TB_LF_SN-MFG]
TP17  Test Point 0.1"  [Test Point 0.1"-Footprint-1]  (value not drawn)  (no BOM)

### Ports
ANALOG_SIG (in), GND, STEMMA_VCC

### Nets
GND: P7.3 ; port GND
STEMMA_VCC: P7.2 ; port STEMMA_VCC  [project net 3V3]
ANALOG_SIG: P7.1 TP17.1(PAD) ; port ANALOG_SIG

Not connected (* = marked no-connect by the designer): P7 4(MNT_1)* 5(MNT_2)*

### Notes on the sheet
- Remember to Recheck the order of 3 wires
  Connect to the drive board of speaker, no need to have filtering
- Title:
- Desc:
- Size:
- Letter
- Auth:
- Proj:
- Sheet
- of
- www.seas.upenn.edu
- Electrical and Systems Engineering

### Library data of the parts
P7 = CMP-2000-07023-2: CONN HEADER SMD R/A 3POS 2MM; Current Rating: 2A; Voltage Rating: 100V; Gender: Male; Number of Contacts: 3; Insulation Resistance: 1GR; Contact Resistance: 10mR; Termination: Solder; Orientation: Right Angle; Pitch: 2mm; Insulation Color: Natural; Flammability Rating: UL94 V-0; Width: 5mm; Max Current Rating: 2A; Lead Free: Lead Free; Mount: Surface Mount; Max Operating Temperature: 85°C; Connector Type: Header; Fastening Type: Detent; Max Voltage Rating (DC): 100V; Housing Material: Polyamide; Number of Rows: 1; Housing Color: Beige; Contact Plating: Tin; Contact Shape: Square; Working Voltage: 100V; Contact Material: Copper Alloy; Contact Mating Length: 0.13inch; Contact Type: Male Pin; Max Voltage Rating (AC): 100V; Packaging: Tape and Reel; Min Operating Temperature: -25°C; Number of Positions: 3; REACH SVHC: No SVHC; Contact Finish - Mating: TIN; Color: Natural; Length: 9.9mm; Insulation Material: Nylon; Depth: 7.6mm; Material: Polyamide; Voltage Rating (AC): 100V; Series: PH; Height: 9.4mm; Number of Poles: 3; Lead Pitch: 2mm
TP17 = CMP-00086-1

## Sheet LCD9pin.SchDoc
size Letter; Author: FF7 HD Remastered
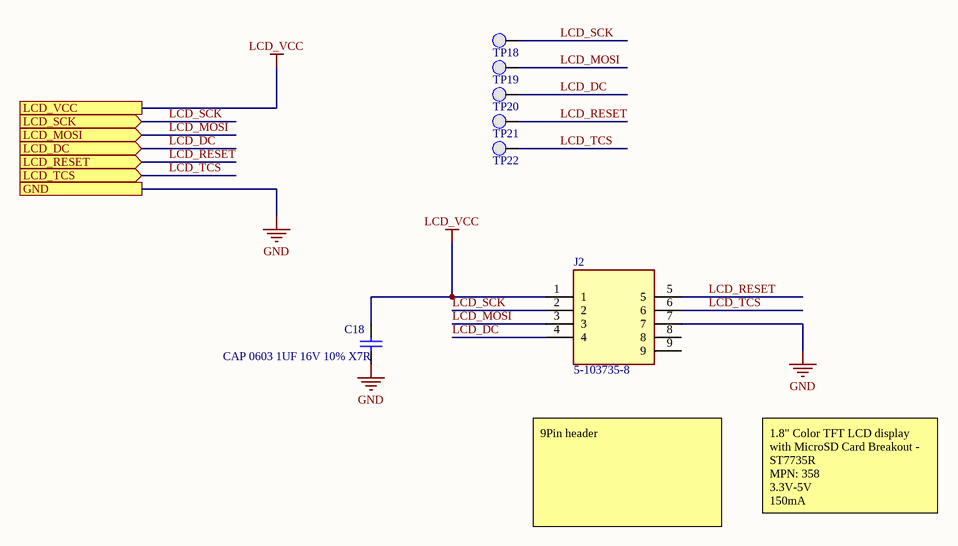
[diagram p6: LCD9pin.SchDoc]

### Parts
C18  CAP 0603 1UF 16V 10% X7R  [0603_CAP]
J2  5-103735-8  [TE_5-103735-8]
TP18  Test Point 0.1"  [Test Point 0.1"-Footprint-1]  (value not drawn)  (no BOM)
TP19  Test Point 0.1"  [Test Point 0.1"-Footprint-1]  (value not drawn)  (no BOM)
TP20  Test Point 0.1"  [Test Point 0.1"-Footprint-1]  (value not drawn)  (no BOM)
TP21  Test Point 0.1"  [Test Point 0.1"-Footprint-1]  (value not drawn)  (no BOM)
TP22  Test Point 0.1"  [Test Point 0.1"-Footprint-1]  (value not drawn)  (no BOM)

### Ports
GND, LCD_DC (in), LCD_MOSI (in), LCD_RESET (in), LCD_SCK (in), LCD_TCS (in), LCD_VCC

### Nets
GND: C18.1 J2.7 ; port GND
LCD_VCC: C18.2 J2.1 ; port LCD_VCC  [project net 3V3]
LCD_DC: J2.4 TP20.1(PAD) ; port LCD_DC  [project net DIGITAL_OUT_2]
LCD_MOSI: J2.3 TP19.1(PAD) ; port LCD_MOSI
LCD_RESET: J2.5 TP21.1(PAD) ; port LCD_RESET  [project net DIGITAL_OUT_3]
LCD_SCK: J2.2 TP18.1(PAD) ; port LCD_SCK
LCD_TCS: J2.6 TP22.1(PAD) ; port LCD_TCS  [project net DIGITAL_OUT_4]

Not connected (* = marked no-connect by the designer): J2 8 9

### Notes on the sheet
- 9Pin header
- 1.8" Color TFT LCD display with MicroSD Card Breakout - ST7735R
  MPN: 358
  3.3V-5V
  150mA
- Title:
- Desc:
- Size:
- Letter
- Auth:
- Proj:
- Sheet
- of
- www.seas.upenn.edu
- Electrical and Systems Engineering

### Library data of the parts
C18 = CMP-011-000286-1: as C12 on sheet MCU; P/N: CAP 0603 1UF 16V 10% X7R; Manufacturer P/N: CAP 0603 1UF 16V 10% X7R; Type: Ceramic X7R; Mount: SMT
J2 = 5-103735-8: Conn Shrouded Header HDR 9 POS 2.54mm Solder ST Thru-Hole Box/Tube; Number_of_Positions: 9; MF: TE Connectivity; Centerline_Pitch: 2.54 mm[.1 in]; Product_Type: Connector; MP: 5-103735-8; SnapEDA_Link: https://www.snapeda.com/parts/5-103735-8/TE%20Connectivity%20AMP%20Connectors/view-part/2675807/?ref=snap; Package: None; Value: *; Digi-Key_Part_Number: A33940-ND
TP18-TP22 = CMP-00086-1

## Sheet TPS62082.SchDoc
size Letter; Author: FF7 HD Remastered
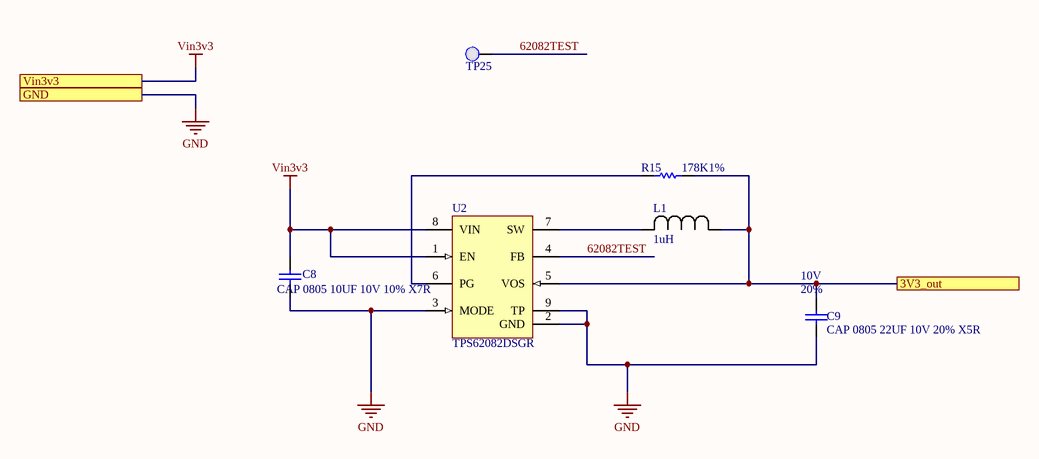
[diagram p7: TPS62082.SchDoc]

### Parts
C8  CAP 0805 10UF 10V 10% X7R  [0805_CAP]
C9  CAP 0805 22UF 10V 20% X5R  Tolerance: 20%  Voltage: 10V  [0805_CAP_60H]
L1  1uH  [IND_16100_WRE]
R15  value 178K  Tolerance: 1%  [0402_RES]  (hidden comment: RES 0402 178K 1%)
TP25  Test Point 0.1"  [Test Point 0.1"-Footprint-1]  (value not drawn)  (no BOM)
U2  TPS62082DSGR  [DSG0008A_V]

### Ports
3V3_out, GND, Vin3v3

### Nets
GND: C8.1 C9.1 U2.2(GND) U2.3(MODE) U2.9(TP) ; port GND
Vin3v3: C8.2 U2.1(EN) U2.8(VIN) ; port Vin3v3
3V3_out: C9.2 L1.1 R15.2 U2.5(VOS) ; port 3V3_out
62082TEST: TP25.1(PAD) U2.4(FB)
NetL1_2: L1.2 U2.7(SW)
NetR15_1: R15.1 U2.6(PG)

### Notes on the sheet
- Title:
- Desc:
- Size:
- Letter
- Auth:
- Proj:
- Sheet
- of
- www.seas.upenn.edu
- Electrical and Systems Engineering

### Library data of the parts
C8 = CMP-011-000478-1: Capacitor Surface Mount 0805 Footprint 10UF 10V 10% Tolerance Ceramic X7R; Manufacturer: Various; Description in Visual: Cap SMT 0805 10UF 10V 10%  Cer X7R; PCB Package: 0805; Type: Ceramic X7R; P/N: CAP 0805 10UF 10V 10% X7R; Manufacturer P/N: CAP 0805 10UF 10V 10% X7R; Mount: SMT
C9 = CMP-011-000507-1: Capacitor Surface Mount 0805 Footprint 22UF 10V 20% Tolerance Ceramic X5R; Manufacturer: Various; PCB Package: 0805; Description in Visual: Cap SMT 0805 22UF 10V 20%  Cer X5R; Value: 22UF; P/N: CAP 0805 22UF 10V 20% X5R; Manufacturer P/N: CAP 0805 22UF 10V 20% X5R; Mount: SMT; Type: Ceramic X5R
L1 = 744316100: No Description Available; Mfr_Name: Wurth Electronics
R15 = CMP-005-000504-3: Resistor Surface Mount, 178K Ohms, 0402 Footprint, 1% Tolerance 0.063W; Manufacturer: Various; PCB Package: 0402; Description in Visual: Res SMT 178K 0402  1%  0.063W; Mount: SMT; Manufacturer P/N: RES 0402 178K 1%; Power Rating: 0.063W
TP25 = CMP-00086-1
U2 = CMP-0323-00344-3: Buck Step Down Regulator with 2.3 to 6 V Input and 3.3 V Output, -40 to 85 degC, 8-Pin WSON (DSG), Green (RoHS & no Sb/Br); Manufacturer: Texas Instruments; Switch Current Limit(Typ)(A): 2.4; Vin(Min)(V): 2.3; Iq(Typ)(mA): 0.006; Regulated Outputs(#): 1; Vout(Max)(V): 3.3; Duty Cycle(Max)(%): 100; Iout(Max)(A): 1.2; SubFamily: Step-Down Regulator; Rating: Catalog; Vin(Max)(V): 6; ComponentLink1Description: Datasheet; ComponentLink3Description: URL Link1; ComponentLink2URL: http://www.ti.com/litv/pdf/mpds308a; DatasheetVersion: SLVSAE8B; PackageVersion: revB, Oct-2010; Eco-Plan: Green (RoHS & no Sb/Br); ComponentLink2Description: Package Specification; PackageReference: DSG0008A; Code_JEDEC: MO-229; Topology: Buck; PartNumber: TPS62082DSGR; PackageDescription: 8-Pin Plastic Small Outline No-Lead, 2 x 2 x 0.8 mm Body, 0.5 mm Pitch, Exposed Pad; ComponentLink1URL: http://www.ti.com/general/docs/lit/getliterature.tsp?genericPartNumber=TPS62082&fileType=pdf; ComponentLink3URL: Samples URL:http://www.ti.com/product/tps62082#samples; Vout(Min)(V): 3.3; Mounting Technology: Surface Mount

## Sheet I2Cpad.SchDoc
size Letter; Author: FF7 HD Remastered
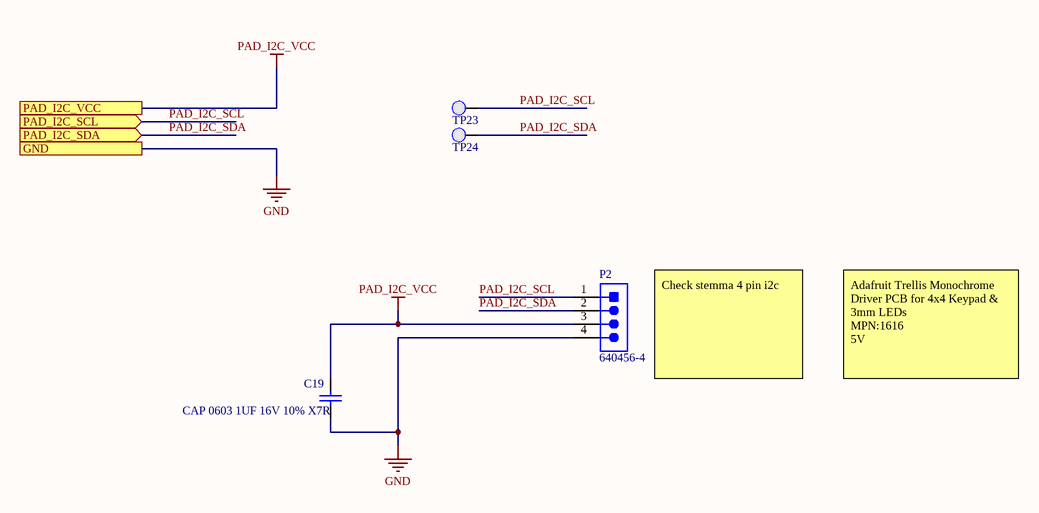
[diagram p8: I2Cpad.SchDoc]

### Parts
C19  CAP 0603 1UF 16V 10% X7R  [0603_CAP]
P2  640456-4  [TECO-640456-4]
TP23  Test Point 0.1"  [Test Point 0.1"-Footprint-1]  (value not drawn)  (no BOM)
TP24  Test Point 0.1"  [Test Point 0.1"-Footprint-1]  (value not drawn)  (no BOM)

### Ports
GND, PAD_I2C_SCL (in), PAD_I2C_SDA (in), PAD_I2C_VCC

### Nets
GND: C19.1 P2.4 ; port GND
PAD_I2C_VCC: C19.2 P2.3 ; port PAD_I2C_VCC  [project net 3V3]
PAD_I2C_SCL: P2.1 TP23.1(PAD) ; port PAD_I2C_SCL
PAD_I2C_SDA: P2.2 TP24.1(PAD) ; port PAD_I2C_SDA

### Notes on the sheet
- Check stemma 4 pin i2c
- Adafruit Trellis Monochrome Driver PCB for 4x4 Keypad & 3mm LEDs
  MPN:1616
  5V
- Title:
- Desc:
- Size:
- Letter
- Auth:
- Proj:
- Sheet
- of
- www.seas.upenn.edu
- Electrical and Systems Engineering

### Library data of the parts
C19 = CMP-011-000286-1: as C12 on sheet MCU; P/N: CAP 0603 1UF 16V 10% X7R; Manufacturer P/N: CAP 0603 1UF 16V 10% X7R; Type: Ceramic X7R; Mount: SMT
P2 = CMP-2000-05419-1: Male Header, Pitch 2.54 mm, 1 x 4 Position, Height 10.03 mm, Tail Length 3.56 mm, RoHS, Bulk; Manufacturer: TE Connectivity; Material, Housing: Polyester; Primary Type: InterconnectSystem; Mount Angle: Vertical; Color, Housing: White; Current, Rating: 5 / A; Agency Approvals: CSA,UL; Contact Termination Area Plating: Tin; Temperature, Operating: -55to+105 / degC; Standards: RoHSCompliant,ELVCompliant,UL94V-0; Number of Positions: 4; Brand/Series: MTA-100Series; Angle: Straight; Pin Spacing: 0.1 / "; Material, Contact: CopperAlloy; Connector Type: MTA-100; Special Features: Pinstrip; Mounting Hole Size: 0.04 / "; Contact Centerline Spacing: 0.100 / in.; Voltage, Rating: 250 / V; Manufacturer URL: http://www.te.com/; Length, Pin: 0.14 / "; Length, Overall: 0.4 / "; Color: White; Flammability Rating: UL94V-0; Mounting Type: PCMount; Termination: Solder; Datasheet URL: https://datasheet.ciiva.com/16286/eng-ds-82056-mta-0608-16286228.pdf; Number of Contacts: 4; Contact Shape: Square; Contact Mating Area Plating: Tin; Length, Terminal Post: 0.14 / in.; Size, Post: 0.025 / in.; Contact Plating: Tin; Type: PCBPlug; Datasheet Version: Dec-14; Number of Rows: 1
TP23 TP24 = CMP-00086-1

## Nets that join several sheets
3V3: MAIN (R7.2 R16.2 R17.2 R24.2), MCU (8 pins), Memory (5 pins), STEMMA (P7.2), LCD9pin (C18.2 J2.1), I2Cpad (C19.2 P2.3)
GND: MAIN (10 pins), FTDI (10 pins), MCU (22 pins), Memory (5 pins), LiPo_Charger (11 pins), STEMMA (P7.3), LCD9pin (C18.1 J2.7), TPS62082 (5 pins), I2Cpad (C19.1 P2.4)
Vbat: MAIN (R34.2), LiPo_Charger (C17.2 U6.2 U6.3)
VBUS: MAIN (J1.1), FTDI (C2.2 D1.4 FB1.1)
Vin: MAIN (R33.2), LiPo_Charger (C24.2 U6.13)
Vin3v3: MAIN (R26.2), TPS62082 (C8.2 U2.1 U2.8)
Vout_BQ: MAIN (R23.1), LiPo_Charger (6 pins)
VUSB: MAIN (R33.1 TP1.1), FTDI (6 pins)
3V3_out: MAIN (R24.1), TPS62082 (C9.2 L1.1 R15.2 U2.5)
ANALOG_OUT: MAIN (R35.1), MCU (U4.31)
ANALOG_SIG: MAIN (R35.2), STEMMA (P7.1 TP17.1)
BQ_BAT_TS: MAIN (R6.2 TP5.1), LiPo_Charger (U6.1)
DIGITAL_OUT_2: MCU (U4.13), LCD9pin (J2.4 TP20.1)
DIGITAL_OUT_3: MCU (U4.22), LCD9pin (J2.5 TP21.1)
DIGITAL_OUT_4: MCU (U4.28), LCD9pin (J2.6 TP22.1)
FLASH_MEM_SPI_SS: MCU (U4.37), Memory (R13.1 SD1.2 TP11.1)
I2C_SCL: MAIN (R16.1 R22.1), MCU (U4.9)
I2C_SDA: MAIN (R17.1 R25.1), MCU (U4.15)
LCD_MOSI: MAIN (R31.2), LCD9pin (J2.3 TP19.1)
LCD_SCK: MAIN (R32.2), LCD9pin (J2.2 TP18.1)
LCD_SPI_MOSI: MAIN (R31.1), MCU (U4.34)
LCD_SPI_SCK: MAIN (R32.1), MCU (U4.35)
MCU_LED: MAIN (D8.K), MCU (U4.16)
MCU_RX_UART_CLI: MAIN (TP4.1), FTDI (U1.7), MCU (U4.44)
MCU_TX_UART_CLI: MAIN (TP2.1), FTDI (U1.10), MCU (U4.43)
MEM_SPI_CLK: MAIN (R10.2), Memory (SD1.5 TP10.1)
MEM_SPI_MISO: MAIN (R9.2), Memory (SD1.7 TP9.1)
MEM_SPI_MOSI: MAIN (R8.2), Memory (SD1.3 TP8.1)
PAD_I2C_SCL: MAIN (R22.2), I2Cpad (P2.1 TP23.1)
PAD_I2C_SDA: MAIN (R25.2), I2Cpad (P2.2 TP24.1)
SERCOM1_PAD2_SPI_MISO: MAIN (R9.1), MCU (U4.8)
SERCOM1_PAD2_SPI_MOSI: MAIN (R8.1), MCU (U4.11)
SERCOM1_PAD3_SPI_SCK: MAIN (R10.1), MCU (U4.12)
USB_DATA_N: MAIN (J1.2), FTDI (C5.2 D1.3 R1.1)
USB_DATA_P: MAIN (J1.3), FTDI (C6.2 D1.2 R2.1)

## Assembly variants
Build_Alt: not fitted FD1 FD2 FD3 J2 J3 P1 P2 P7 TP1 TP2 TP3 TP4 TP5 TP6 TP7 TP8 TP9 TP10 TP11 TP12 TP13 TP14 TP15 TP16 TP17 TP18 TP19 TP20 TP21 TP22 TP23 TP24 U3